# Altium schematic sheet nguon.SchDoc
size A
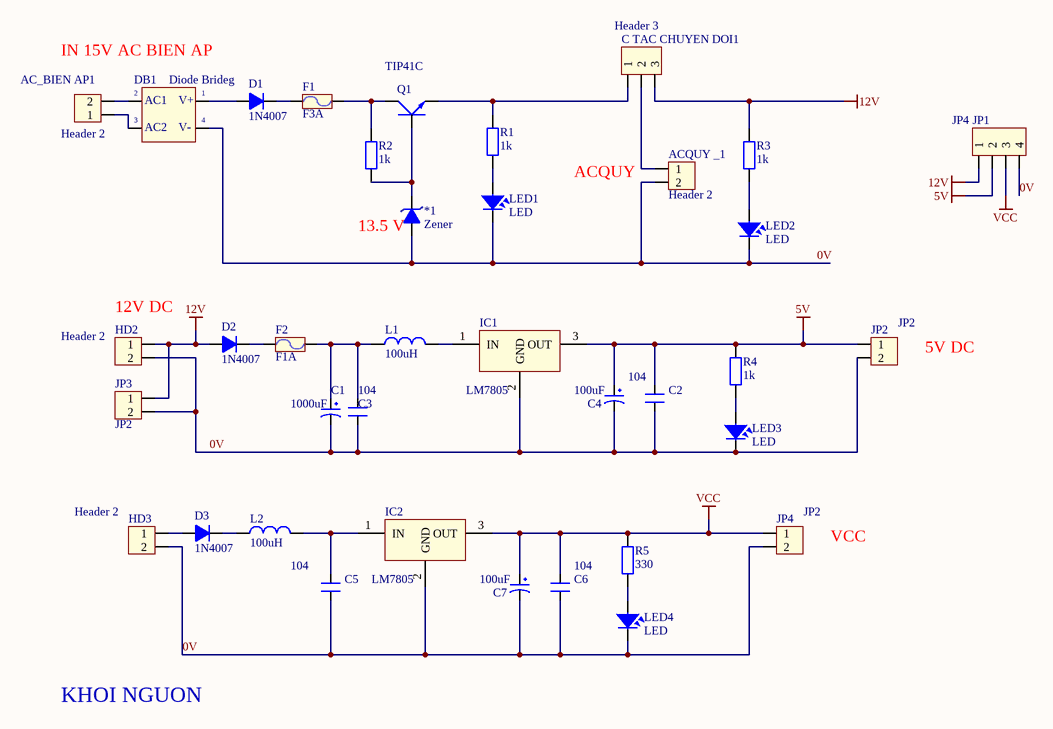
[diagram p0: nguon.SchDoc]

## Parts
*1  Zener  [D1A]
AC_BIEN_AP1  Header 2  [HED2]
ACQUY__1  Header 2  [HED2]
C1  1000uF  [CP1.5/3.4]
C2  104  [CN2]
C3  104  [CN2]
C4  100uF  [CP1/2.5]
C5  104  [CN2]
C6  104  [CN2]
C7  100uF  [CP1/2.5]
C_TAC_CHUYEN_DOI1  Header 3  [HED3]
D1  1N4007  [D1A]
D2  1N4007  [D1A]
D3  1N4007  [D1A]
DB1  Diode Brideg  [CAU 1A]
F1  F3A  [Fuse]
F2  F1A  [Fuse]
HD2  Header 2  [HED2]
HD3  Header 2  [HED2]
IC1  LM7805  [QTO-220]
IC2  LM7805  [QTO-220]
JP1  JP4  [CON4]
JP2  JP2  [CON2]
JP3  JP2  [CON2]
JP4  JP2  [CON2]
L1  100uH  [L/0.4]
L2  100uH  [L/0.4]
LED1  LED  [LED-3]
LED2  LED  [LED-3]
LED3  LED  [LED-3]
LED4  LED  [LED-3]
Q1  TIP41C  [QTO-220]
R1  1k  [R1/4W]
R2  1k  [R1/4W]
R3  1k  [R1/4W]
R4  1k  [R1/4W]
R5  330  [R1/4W]

## Nets
5V: C2.2 C4.1 IC1.3(OUT) JP1.2 JP2.1 R4.1
12V: C_TAC_CHUYEN_DOI1.3 D2.1(A) HD2.1 JP1.1 JP3.1 R3.2
VCC: C6.2 C7.1 IC2.3(OUT) JP1.3 JP4.1 R5.1
0V: *1.1(A) ACQUY__1.2 C1.2 C2.1 C3.1 C4.2 C5.1 C6.1 C7.2 DB1.4(-V_OUT) HD2.2 HD3.2 IC1.2(GND) IC2.2(GND) JP1.4 JP2.2 JP3.2 JP4.2 LED1.2 LED2.2 LED3.2 LED4.2
Net*1_2: *1.2(K) Q1.1(B) R2.1
NetAC_BIEN_AP1_1: AC_BIEN_AP1.1 DB1.3(AC2)
NetAC_BIEN_AP1_2: AC_BIEN_AP1.2 DB1.2(AC1)
NetACQUY__1_1: ACQUY__1.1 C_TAC_CHUYEN_DOI1.2
NetC1_1: C1.1 C3.2 F2.2 L1.1
NetC5_2: C5.2 IC2.1(IN) L2.2
NetC_TAC_CHUYEN_DOI1_1: C_TAC_CHUYEN_DOI1.1 Q1.3(E) R1.2
NetD1_1: D1.1(A) DB1.1(+V_OUT)
NetD1_2: D1.2(K) F1.1
NetD2_2: D2.2(K) F2.1
NetD3_1: D3.1(A) HD3.1
NetD3_2: D3.2(K) L2.1
NetF1_2: F1.2 Q1.2(C) R2.2
NetIC1_1: IC1.1(IN) L1.2
NetLED1_1: LED1.1 R1.1
NetLED2_1: LED2.1 R3.1
NetLED3_1: LED3.1 R4.2
NetLED4_1: LED4.1 R5.2

## Notes on the sheet
- IN 15V AC BIEN AP
- (near HD2) 12V DC
- 5V DC
- KHOI NGUON
- Labels drawn without touching a wire or pin: 13.5 V, ACQUY, VCC
- (in symbol DB) V+; V-

## Library data of the parts
AC_BIEN_AP1 ACQUY__1 HD2 HD3 = Hed2: Header 2 (Green); Value: Header 2
C1 = CP4: Cap 1000uF/16V - 220uF/50V; Description 5: 4,7uF>10uF/250V_3,3uF>10uF/400V - 2,2uF>4,7uF/450V; Description 1: 2200uF-3300uF/6,3V - 1000uF-2200uF/10V; Description 2: 1000uF/16V - 470uF => 1000uF/25V - 100uF/100V; Description 3: 330uF>470uF/35V_220uF>470uF/50V_10uF>22uF/250V; Description 4: 220uF => 330uF/63V - 10uF =>33uF/160 - 200V; Value: 1000uF/16V
C2 C3 C5 C6 = CN2: Cap np 104 => 105pF; Value: 0.1uF; Description: Cap np Cremic Value  104pF => 105pF
C4 C7 = CP2: C 47uF/50V , 220uF/16V; Value: 47uF/16 - 50V; Description 1: 470uF/6,3V - 330uF/10V - 220uF/16V; Description 2: 100uF/25V - 35V - 47uF/50V - 22uF/100V; Description 3: 33uF => 47uF/63V - 1uF => 4,7uF/160V; Description 4: 1uF => 2,2uF/250V - 1uF/350V
C_TAC_CHUYEN_DOI1 = Hed3: Header 3 (Green); Value: Header 3
D1-D3 = D1A: Diode 1A; Value: 1N4007
DB1 = DB: Convert AC to DC voltage, 4 pin; Value: Cau 1A
F1 F2 = Fuse: Designed by: VanDungEvn; Value: Fuse
IC1 IC2 = LM78xx: On ap +, from + 5 to + 24VDC; Value: LM7805
JP1 = Con4: Connector 4; Value: Connector 4
JP2-JP4 = Con2: Connector 2; Value: Connector 2
L1 L2 = L1: Inductor; Value: 150 mH
LED1-LED4 = LED: LED Single colour Green and Red; Value: LED 3 ly Single Colour; Description: LED 5 ly Single Colour; Description: Led  Vuong
Q1 = TIP41C: NPN 2W, BCE; Value: TIP41C
R1-R5 = R1/4W: Resistor 1/4W; Value: R1/4W - 1K